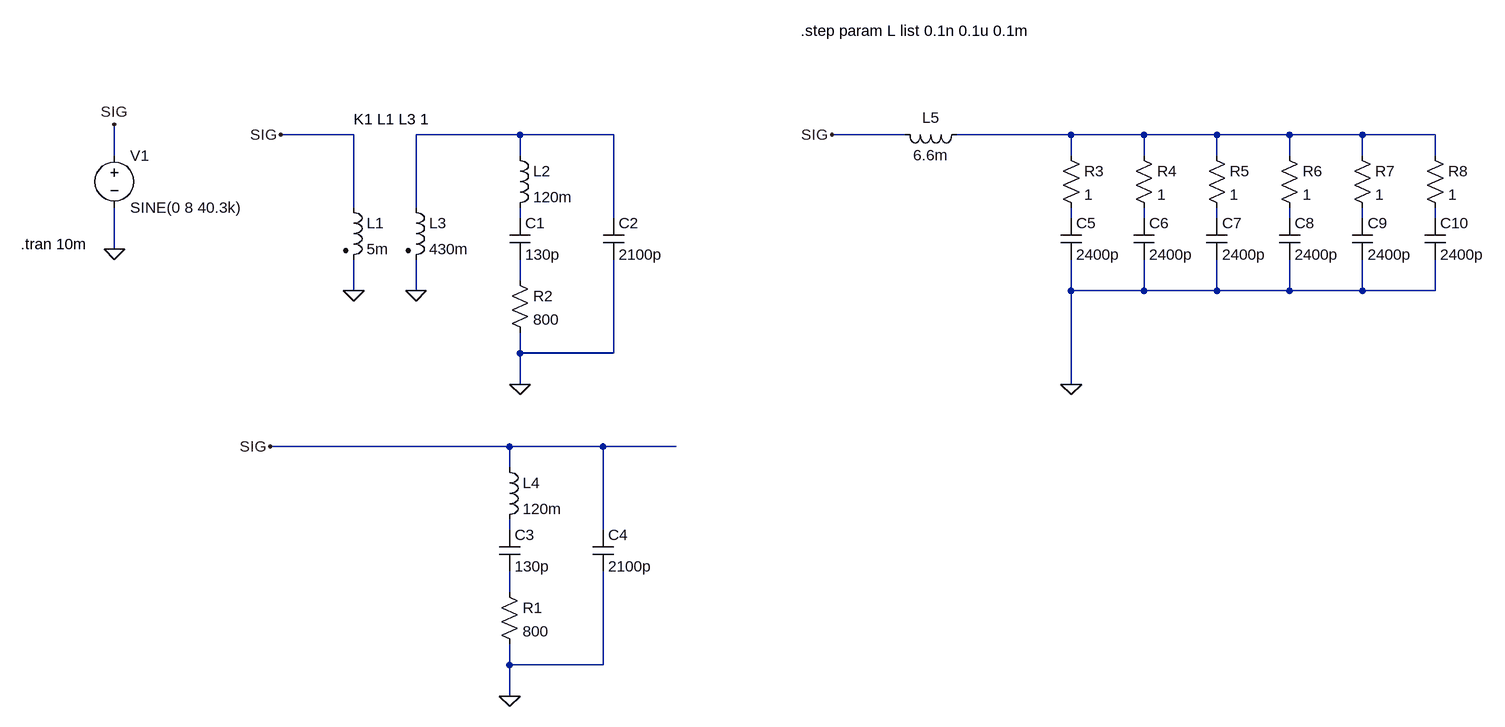
[diagram p0: schematic LC-resonance.asc]
LC-resonance.asc, the LTspice schematic file:
Version 4
SHEET 1 2276 980
WIRE 480 96 368 96
WIRE 736 96 576 96
WIRE 880 96 736 96
WIRE 1328 96 1216 96
WIRE 1584 96 1408 96
WIRE 1696 96 1584 96
WIRE 1808 96 1696 96
WIRE 1920 96 1808 96
WIRE 2032 96 1920 96
WIRE 2144 96 2032 96
WIRE 112 128 112 80
WIRE 736 128 736 96
WIRE 1584 128 1584 96
WIRE 1696 128 1696 96
WIRE 1808 128 1808 96
WIRE 1920 128 1920 96
WIRE 2032 128 2032 96
WIRE 2144 128 2144 96
WIRE 480 208 480 96
WIRE 576 208 576 96
WIRE 736 224 736 208
WIRE 880 224 880 96
WIRE 1584 224 1584 208
WIRE 1696 224 1696 208
WIRE 1808 224 1808 208
WIRE 1920 224 1920 208
WIRE 2032 224 2032 208
WIRE 2144 224 2144 208
WIRE 112 272 112 208
WIRE 736 320 736 288
WIRE 480 336 480 288
WIRE 576 336 576 288
WIRE 1584 336 1584 288
WIRE 1696 336 1696 288
WIRE 1696 336 1584 336
WIRE 1808 336 1808 288
WIRE 1808 336 1696 336
WIRE 1920 336 1920 288
WIRE 1920 336 1808 336
WIRE 2032 336 2032 288
WIRE 2032 336 1920 336
WIRE 2144 336 2144 288
WIRE 2144 336 2032 336
WIRE 736 432 736 400
WIRE 880 432 880 288
WIRE 880 432 736 432
WIRE 736 480 736 432
WIRE 1584 480 1584 336
WIRE 720 576 352 576
WIRE 864 576 720 576
WIRE 976 576 864 576
WIRE 720 608 720 576
WIRE 720 704 720 688
WIRE 864 704 864 576
WIRE 720 800 720 768
WIRE 720 912 720 880
WIRE 864 912 864 768
WIRE 864 912 720 912
WIRE 720 960 720 912
FLAG 112 272 0
FLAG 112 80 SIG
FLAG 368 96 SIG
FLAG 736 480 0
FLAG 480 336 0
FLAG 576 336 0
FLAG 352 576 SIG
FLAG 720 960 0
FLAG 1216 96 SIG
FLAG 1584 480 0
SYMBOL voltage 112 112 R0
WINDOW 123 0 0 Left 0
WINDOW 39 0 0 Left 0
SYMATTR InstName V1
SYMATTR Value SINE(0 8 40.3k)
SYMBOL ind 720 112 R0
SYMATTR InstName L2
SYMATTR Value 120m
SYMBOL cap 720 224 R0
SYMATTR InstName C1
SYMATTR Value 130p
SYMBOL res 720 304 R0
SYMATTR InstName R2
SYMATTR Value 800
SYMBOL cap 864 224 R0
SYMATTR InstName C2
SYMATTR Value 2100p
SYMBOL ind2 464 192 R0
SYMATTR InstName L1
SYMATTR Value 5m
SYMATTR SpiceLine Rser=2m
SYMBOL ind2 560 192 R0
SYMATTR InstName L3
SYMATTR Value 430m
SYMBOL ind 704 592 R0
SYMATTR InstName L4
SYMATTR Value 120m
SYMBOL cap 704 704 R0
SYMATTR InstName C3
SYMATTR Value 130p
SYMBOL res 704 784 R0
SYMATTR InstName R1
SYMATTR Value 800
SYMBOL cap 848 704 R0
SYMATTR InstName C4
SYMATTR Value 2100p
SYMBOL cap 1568 224 R0
SYMATTR InstName C5
SYMATTR Value 2400p
SYMBOL res 1568 112 R0
SYMATTR InstName R3
SYMATTR Value 1
SYMBOL ind 1424 80 R90
WINDOW 0 5 56 VBottom 2
WINDOW 3 32 56 VTop 2
SYMATTR InstName L5
SYMATTR Value 6.6m
SYMBOL cap 1680 224 R0
SYMATTR InstName C6
SYMATTR Value 2400p
SYMBOL res 1680 112 R0
SYMATTR InstName R4
SYMATTR Value 1
SYMBOL cap 1792 224 R0
SYMATTR InstName C7
SYMATTR Value 2400p
SYMBOL res 1792 112 R0
SYMATTR InstName R5
SYMATTR Value 1
SYMBOL cap 1904 224 R0
SYMATTR InstName C8
SYMATTR Value 2400p
SYMBOL res 1904 112 R0
SYMATTR InstName R6
SYMATTR Value 1
SYMBOL cap 2016 224 R0
SYMATTR InstName C9
SYMATTR Value 2400p
SYMBOL res 2016 112 R0
SYMATTR InstName R7
SYMATTR Value 1
SYMBOL cap 2128 224 R0
SYMATTR InstName C10
SYMATTR Value 2400p
SYMBOL res 2128 112 R0
SYMATTR InstName R8
SYMATTR Value 1
TEXT -32 264 Left 2 !.tran 10m
TEXT 480 72 Left 2 !K1 L1 L3 1
TEXT 1168 -64 Left 2 !.step param L list 0.1n 0.1u 0.1m

The netlist it stands for:
* LC-resonance.asc
V1 SIG 0 SINE(0 8 40.3k)
L2 N001 N003 120m
C1 N003 N010 130p
R2 N010 0 800
C2 N001 0 2100p
L1 SIG 0 5m Rser=2m
L3 N001 0 430m
L4 SIG N011 120m
C3 N011 N012 130p
R1 N012 0 800
C4 SIG 0 2100p
C5 N004 0 2400p
R3 N002 N004 1
L5 N002 SIG 6.6m
C6 N005 0 2400p
R4 N002 N005 1
C7 N006 0 2400p
R5 N002 N006 1
C8 N007 0 2400p
R6 N002 N007 1
C9 N008 0 2400p
R7 N002 N008 1
C10 N009 0 2400p
R8 N002 N009 1
.tran 10m
K1 L1 L3 1
.step param L list 0.1n 0.1u 0.1m
.backanno
.end